# Altium schematic sheet nRF8001-Reference Schematic_DCDC_rev1_0.SchDoc: nRF8001 - Reference Schematic DCDC
size A4; Revision: 1.0; SheetNumber: 1; SheetTotal: 1; DrawnBy: RUBR; DocumentSize: A4
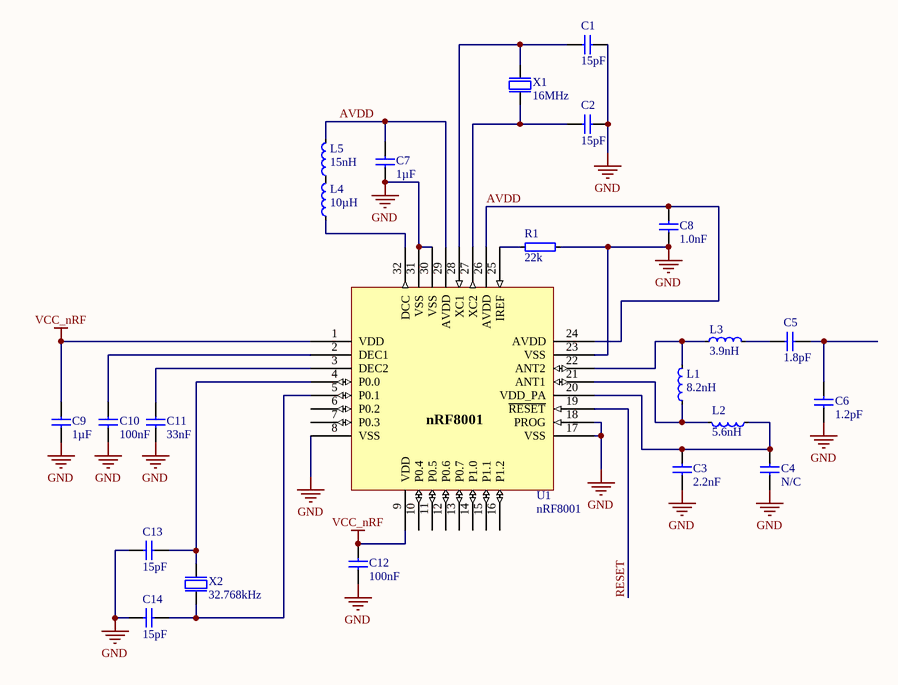
[diagram p0: nRF8001-Reference Schematic_DCDC_rev1_0.SchDoc]

## Parts
C1  15pF  [0402s]
C2  15pF  [0402s]
C3  2.2nF  [0402s]
C4  N/C  [0402s]
C5  1.8pF  [0402s]
C6  1.2pF  [0402s]
C7  1µF  [0603s]
C8  1.0nF  [0402s]
C9  1µF  [0603s]
C10  100nF  [0402s]
C11  33nF  [0402s]
C12  100nF  [0402s]
C13  15pF  [0402s]
C14  15pF  [0402s]
L1  8.2nH  [0402s]
L2  5.6nH  [0402s]
L3  3.9nH  [0402s]
L4  10µH  [0603s]
L5  15nH  [0402s]
R1  22k  [0402s]
U1  nRF8001  [Nordic_QFN50P500X500X90-33N]
X1  16MHz  [BT-XTAL_3225]
X2  32.768kHz  [FC-135]

## Nets
GND: C1.1 C2.1 C3.1 C4.1 C6.2 C7.1 C8.2 C9.1 C10.1 C11.1 C12.1 C13.1 C14.1 R1.2 U1.8(VSS) U1.17(VSS) U1.18(PROG) U1.23(VSS) U1.30(VSS) U1.31(VSS) U1.33(GND) X1.2(GND) X1.4(GND)
VCC_nRF: C9.2 C12.2 U1.1(VDD) U1.9(VDD)
AVDD: C7.2 C8.1 L5.2 U1.24(AVDD) U1.26(AVDD) U1.29(AVDD)
RESET: U1.19(~{RESET})
NetC1_2: C1.2 U1.28(XC1) X1.1(inp)
NetC2_2: C2.2 U1.27(XC2) X1.3(out)
NetC3_2: C3.2 C4.2 L2.1 U1.20(VDD_PA)
NetC5_1: C5.1 C6.1
NetC5_2: C5.2 L3.2
NetC10_2: C10.2 U1.2(DEC1)
NetC11_2: C11.2 U1.3(DEC2)
NetC13_2: C13.2 U1.4(P0.0) X2.1(inp)
NetC14_2: C14.2 U1.5(P0.1) X2.2(out)
NetL1_1: L1.1 L2.2 U1.21(ANT1)
NetL1_2: L1.2 L3.1 U1.22(ANT2)
NetL4_1: L4.1 U1.32(DCC)
NetL4_2: L4.2 L5.1
NetR1_1: R1.1 U1.25(IREF)

Not connected (* = marked no-connect by the designer): U1 6(P0.2) 7(P0.3) 10(P0.4) 11(P0.5) 12(P0.6) 13(P0.7) 14(P1.0) 15(P1.1) 16(P1.2)

## Notes on the sheet
- Title
- Size
- Date:
- Project Number
- Sheet         of
- Revision
- File:
- Drawn By:

## Library data of the parts
C1 C2 C13 C14 = C0402-15p: Chip Cap 0402 NP0; Note: Chip Cap 5%; Artikkelnr Noca: 20029141; Value: 15pF; Published: 2009-05-08; LatestRevisionDate: 2009-11-23; Publisher: Nordic Semiconductor; Part Number: C0402-15p; Manufacturer: *; Manufacturer Part Number: *; Datasheet: *; Pin Count: 2; Supplier: *
C3 = C0402-2n2: Chip Cap 0402 X7R 10%; Note: Chip Cap X7R 10%; Artikkelnr Noca: 20039221; Part Number: C0402-2n2; Manufacturer: *; Manufacturer Part Number: *; Datasheet: *; LatestRevisionDate: 2009-11-23; Pin Count: 2; Publisher: Nordic Semiconductor; Published: 2009-05-08; Value: 2.2nF; Supplier: *; Supplier part number: *; 2nd source Supplier: *; 2nd source part number: *
C4 = C0402-N.C.: Chip Cap 0402; Artikkelnr Noca: N.A.; Part Number: C0402-N.C.; Manufacturer: *; Manufacturer Part Number: *; Datasheet: *; LatestRevisionDate: 2009-05-08; Pin Count: 2; Publisher: Nordic Semiconductor; Published: 2009-05-08; Value: N/C; Note: Chip Cap; Supplier: *; Supplier part number: *; 2nd source Supplier: *; 2nd source part number: *
C5 = C0402-1.8p: Chip Cap 0402 NP0 +/-0.1pF; Manufacturer: JOHANSON TECHNOLOGY; Manufacturer Part Number: 500R07S1R8BV4T; 2nd source part number: 1650788; Note: Chip Cap NP0  +/-0.1pF; Artikkelnr Noca: N.A.; Part Number: C0402-1.8p; Datasheet: http://www.farnell.com/datasheets/321205.pdf; LatestRevisionDate: 2009-05-08; Pin Count: 2; Publisher: Nordic Semiconductor; Published: 2009-05-08; Value: 1.8pF; Supplier: *; Supplier part number: *; 2nd source Supplier: Farnell
C6 = C0402-1.2p: Chip Cap 0402 NP0 5%; Note: Chip Cap NP0 5%; Artikkelnr Noca: 20029157; Part Number: C0402-1.2p; Manufacturer: *; Manufacturer Part Number: *; Datasheet: *; LatestRevisionDate: 2009-05-08; Pin Count: 2; Publisher: Nordic Semiconductor; Published: 2009-05-08; Value: 1.2pF; Supplier: *; Supplier part number: *; 2nd source Supplier: *; 2nd source part number: *
C7 C9 = C0603-1µ0: X7R, 10V; Manufacturer: TAIYO YUDEN; Manufacturer Part Number: LMK107B7105KA-T; Note: Chip Cap 10% X7R; Published: 2009-05-08; LatestRevisionDate: 2009-11-23; Publisher: Nordic Semiconductor; Value: 1µF; Part Number: C0603-1µ0; Datasheet: http://www.yuden.co.jp/us/product/capacitor/LMK107B7105KA-T.html; Pin Count: 2; Supplier: Farnell; Artikkelnr Noca: *; Supplier Part Number: 1683674
C8 = C0402-1n0: Chip Cap 0402 X7R 10%; Note: Chip Cap X7R 10%; Artikkelnr Noca: 20039223; Published: 2009-05-08; LatestRevisionDate: 2009-11-23; Publisher: Nordic Semiconductor; Value: 1.0nF; Part Number: C0402-1n0; Manufacturer: *; Manufacturer Part Number: *; Datasheet: *; Pin Count: 2; Supplier: *
C10 C12 = C0402-100n: Chip Cap 0402 X7R; Note: Chip Cap 10%; Artikkelnr Noca: 20039200; Published: 2009-05-08; LatestRevisionDate: 2009-11-23; Publisher: Nordic Semiconductor; Value: 100nF; Part Number: C0402-100n; Manufacturer: *; Manufacturer Part Number: *; Datasheet: *; Pin Count: 2; Supplier: *
C11 = C0402-33n: Chip Cap 0402 X7R; Note: Chip Cap 10%; Artikkelnr Noca: 20039222; Published: 2009-05-08; LatestRevisionDate: 2009-11-23; Publisher: Nordic Semiconductor; Value: 33nF; Part Number: C0402-33n; Manufacturer: *; Manufacturer Part Number: *; Datasheet: *; Pin Count: 2; Supplier: *
L1 = L0402-8n2: Chip Ind 0402; Manufacturer: Murata; Manufacturer Part Number: LQP15MN8N2B02D; Note: LQP15MN8N2B02D 8.2nH 110mA 0402; Artikkelnr Noca: 33029139; Part Number: L0402-8n2; Datasheet: http://search.murata.co.jp/Ceramy/image/img/PDF/ENG/L0075S0084LQP15M.pdf; Footprint: 0402; LatestRevisionDate: 2009-11-23; Pin Count: 2; Publisher: Nordic Semiconductor; Published: 2009-05-08; Value: 8.2nH; Supplier: Digi-Key; Supplier part number: 490-1135-1-ND; 2nd source Supplier: *; 2nd source part number: *
L2 = L0402-5n6: Chip Ind 0402; Manufacturer: Murata; Manufacturer Part Number: LQP15MN5N6B02D; Note: LQP15MN5N6B02D 5.6nH 140mA 0402; Artikkelnr Noca: 33029161; Part Number: L0402-5n6; Datasheet: http://search.murata.co.jp/Ceramy/image/img/PDF/ENG/L0075S0084LQP15M.pdf; Footprint: 0402; LatestRevisionDate: 2009-11-23; Pin Count: 2; Publisher: Nordic Semiconductor; Published: 2009-05-08; Value: 5.6nH; Supplier: Digi-Key; Supplier part number: 490-1133-1-ND; 2nd source Supplier: *; 2nd source part number: *
L3 = L0402-3n9: Chip Ind 0402; Manufacturer: Murata; Manufacturer Part Number: LQP15MN3N9B02D; Note: LQP15MN3N9B02D 3.9nH 170mA 0402; Artikkelnr Noca: 33029151; Part Number: L0402-3n9; Datasheet: http://search.murata.co.jp/Ceramy/image/img/PDF/ENG/L0075S0084LQP15M.pdf; Footprint: 0402; LatestRevisionDate: 2009-11-23; Pin Count: 2; Publisher: Nordic Semiconductor; Published: 2009-05-08; Value: 3.9nH; Supplier: Digi-Key; Supplier part number: 490-1131-1-ND; 2nd source Supplier: *; 2nd source part number: *
L4 = L0603-10µ: Chip Ind 0603; Manufacturer: Taiyo Yuden; Manufacturer Part Number: LBMF1608T100K; 2nd source part number: 178-6105; Note: LBMF1608T100K 10µH 80mA 0603; Part Number: L0603-10µ; Datasheet: http://www.yuden.co.jp/ut/product/pdf/elb2_e.pdf; Footprint: 0603; LatestRevisionDate: 2010-07-12; Pin Count: 2; Publisher: Nordic Semiconductor; Published: 2010-02-24; Value: 10µH; Supplier: Digi-Key; Supplier part number: 587-1714-1-ND; 2nd source Supplier: Farnell; Artikkelnr Noca: *
L5 = L0402-15n: Chip Ind 0402; LatestRevisionDate: 2010-07-12; Publisher: Nordic Semiconductor; Published: 2010-07-12; Value: 15nH; Part Number: L0402-15n; Manufacturer: *; Manufacturer Part Number: *; Datasheet: *; Footprint: 0402; Pin Count: 2; Note: *; Supplier: *; Artikkelnr Noca: *; Supplier part number: *; 2nd source Supplier: *; 2nd source part number: *
R1 = R0402-22k: Chip Res 0402 1%; Note: Chip Res 1%; Artikkelnr Noca: 27049105; Published: 2009-05-08; LatestRevisionDate: 2009-11-23; Publisher: Nordic Semiconductor; Value: 22k; Part Number: R0402-22k; Manufacturer: *; Manufacturer Part Number: *; Datasheet: *; Footprint: 0402; Pin Count: 2; Supplier: *
U1 = nRF8001: nRF8001 Bluetooth LE chip; Manufacturer: Nordic Semiconductor; Note: nRF8001 - QFN32; Part Number: nRF8001; Manufacturer Part Number: *; Datasheet: *; Footprint: QFN-32; LatestRevisionDate: 2010-02-24; Pin Count: 32; Publisher: Nordic Semiconductor; Published: 2010-02-24; Value: nRF8001; Supplier: Nordic Semiconductor; Supplier part number: *; 2nd source Supplier: *; 2nd source part number: *; Artikkelnr Noca: *
X1 = XTAL SMD 16MHz (3225): XTAL SMD 16MHz, 9pF, Mercury; Note: XTAL SMD 16MHz 3225; Artikkelnr Noca: 22019087; Value: 16MHz; Part Number: XTAL SMD 16MHz (3225); Manufacturer: *; Manufacturer Part Number: *; Datasheet: http://ndap3-net.ebz.epson.co.jp/w/www/PDFS/epdoc_qd.nsf/85a4e2c523a1f89349257068002f9e30/31e98956c8f991cd4925707c003b38b1/$FILE/FA-238_238V_TSX-3225_E08X.pdf; LatestRevisionDate: 2010-02-24; Pin Count: 4; Publisher: Nordic Semiconductor; Published: 2009-05-30; Supplier: *; Supplier part number: *; 2nd source Supplier: *; 2nd source part number: *
X2 = XTAL_FC-135 32.768k: EPSON TOYOCOM - FC-135 32.768KHZ ±20PPM,9.0PF - CRYSTAL, SM, WATCH; Note: XTAL SMD 32.768kHz, 3215; Artikkelnr Noca: 2.20191e+007; Part Number: XTAL_FC-135 32.768k; Manufacturer: Epson Toyocom; Manufacturer Part Number: FC-135 32.768KHZ ±20PPM,9.0PF; Datasheet: http://www.farnell.com/datasheets/57480.pdf; LatestRevisionDate: 2010-10-18; Pin Count: 2; Publisher: Nordic Semiconductor; Published: 2010-10-18; Value: 32.768kHz; Supplier: Farnell; Supplier part number: 127-8037; 2nd source Supplier: *; 2nd source part number: *